# EAGLE design NMEA0183Breakout-ISO-4.3 (EAGLE 9.6.2)
Assembly variants: NMEA0183, JLCPCB

## Sheet 1 of 4
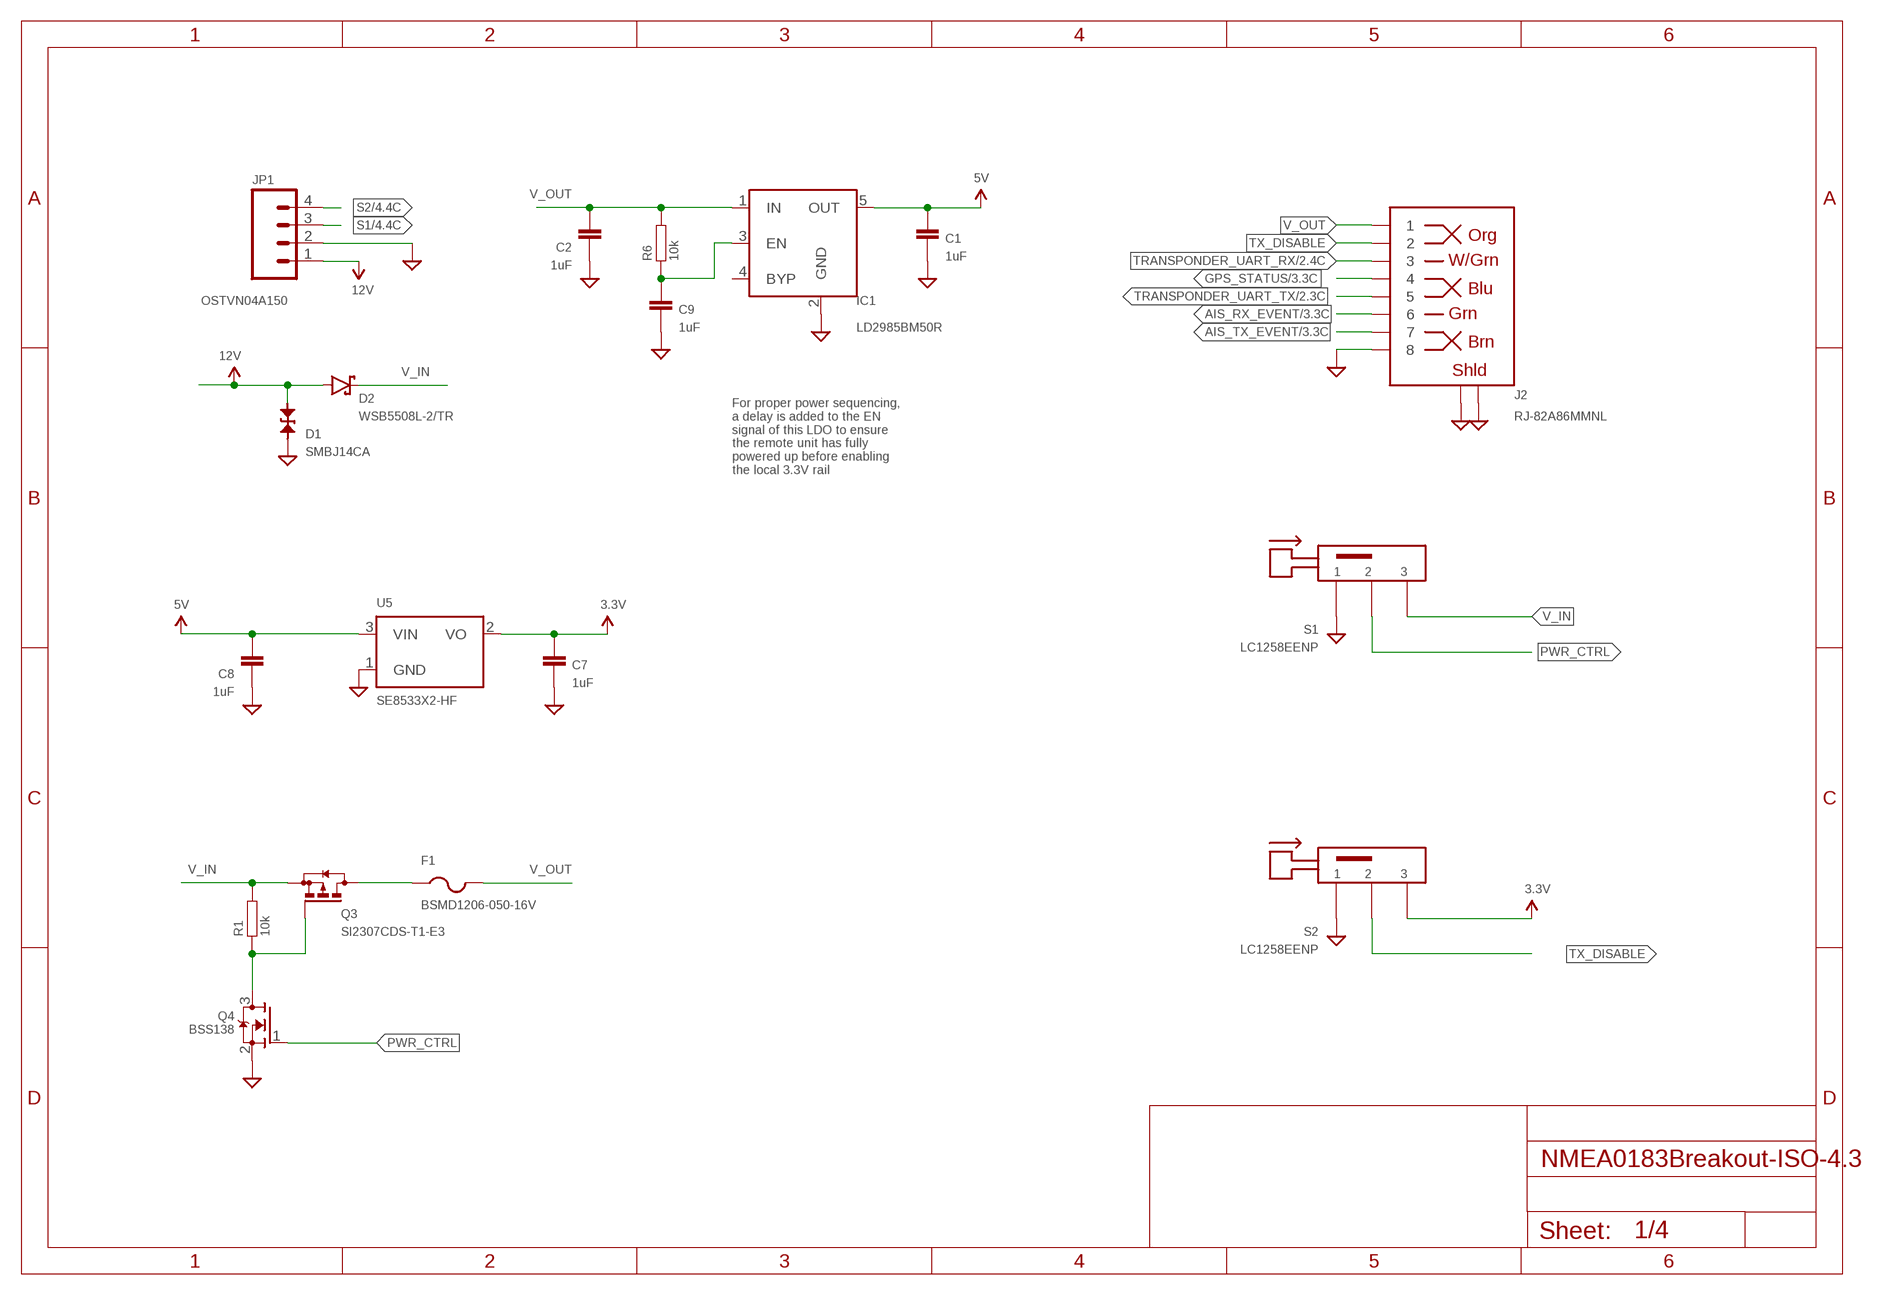
[diagram p0: schematic, sheet 1]

### Parts
C1  1uF  CAPACITOR0603  [0603]
C2  1uF  CAPACITOR0603  [0603]
C7  1uF  CAPACITOR0603  [0603]
C8  1uF  CAPACITOR0603  [0603]
C9  1uF  CAPACITOR0603  [0603]
D1  SMBJ14CA  DIODE-TVS-BIDIRSMB  [SMB-BIDIR]
D2  WSB5508L-2/TR  DIODE-SCHOTTKYSOD123  [SOD123]
F1  BSMD1206-050-16V  PTCFUSE-1206  [R1206]
IC1  LD2985BM50R  MIC5219XX  [SOT23-5]
J2  RJ-82A86MMNL  [RJ-82A86MMNL]
JP1  OSTVN04A150  M04PTH  [1X04]
Q3  SI2307CDS-T1-E3  BSS84  [SOT23]
Q4  BSS138  MOSFET-NREFLOW  [SOT23]
R1  10k  RESISTOR0603  [0603]
R6  10k  RESISTOR0603  [0603]
S1  LC1258EENP  LC1258XXNP  [LC1258XXNP]
S2  LC1258EENP  LC1258XXNP  [LC1258XXNP]
U5  SE8533X2-HF  MCP1799T  [SOT23]

### Nets
3.3V: C7.P$1 S2.P$3 U5.2(VO) ; also sheet 2,3
5V: C1.P$1 C8.P$1 IC1.5(OUT) U5.3(VIN) ; also sheet 4
12V: D1.A D2.A JP1.1
AIS_RX_EVENT: J2.P$6 ; also sheet 3
AIS_TX_EVENT: J2.P$7 ; also sheet 3
GND: C1.P$2 C2.P$2 C7.P$2 C8.P$2 C9.P$2 D1.C IC1.2(GND) J2.P$8 J2.P$9(SHLD) J2.P$10(SHLD) J2.P$11(SHLD) J2.P$12(SHLD) JP1.2 Q4.2(S) S1.P$1 S2.P$1 U5.1(GND) ; also sheet 2,3,4
GPS_STATUS: J2.P$4 ; also sheet 3
N$7: C9.P$1 IC1.3(EN) R6.P$1
N$8: Q3.1(G) Q4.3(D) R1.P$1
N$10: F1.1 Q3.3(D)
PWR_CTRL: Q4.1(G) S1.P$2
S1: JP1.3 ; also sheet 4
S2: JP1.4 ; also sheet 4
TRANSPONDER_UART_RX: J2.P$3 ; also sheet 2
TRANSPONDER_UART_TX: J2.P$5 ; also sheet 2,4
TX_DISABLE: J2.P$2 S2.P$2
V_IN: D2.C Q3.2(S) R1.P$2 S1.P$3
V_OUT: C2.P$1 F1.2 IC1.1(IN) J2.P$1 R6.P$2
Unconnected: IC1.4(BYP)

### Notes on the sheet
- For proper power sequencing,
  a delay is added to the EN
  signal of this LDO to ensure
  the remote unit has fully
  powered up before enabling
  the local 3.3V rail

## Sheet 2 of 4
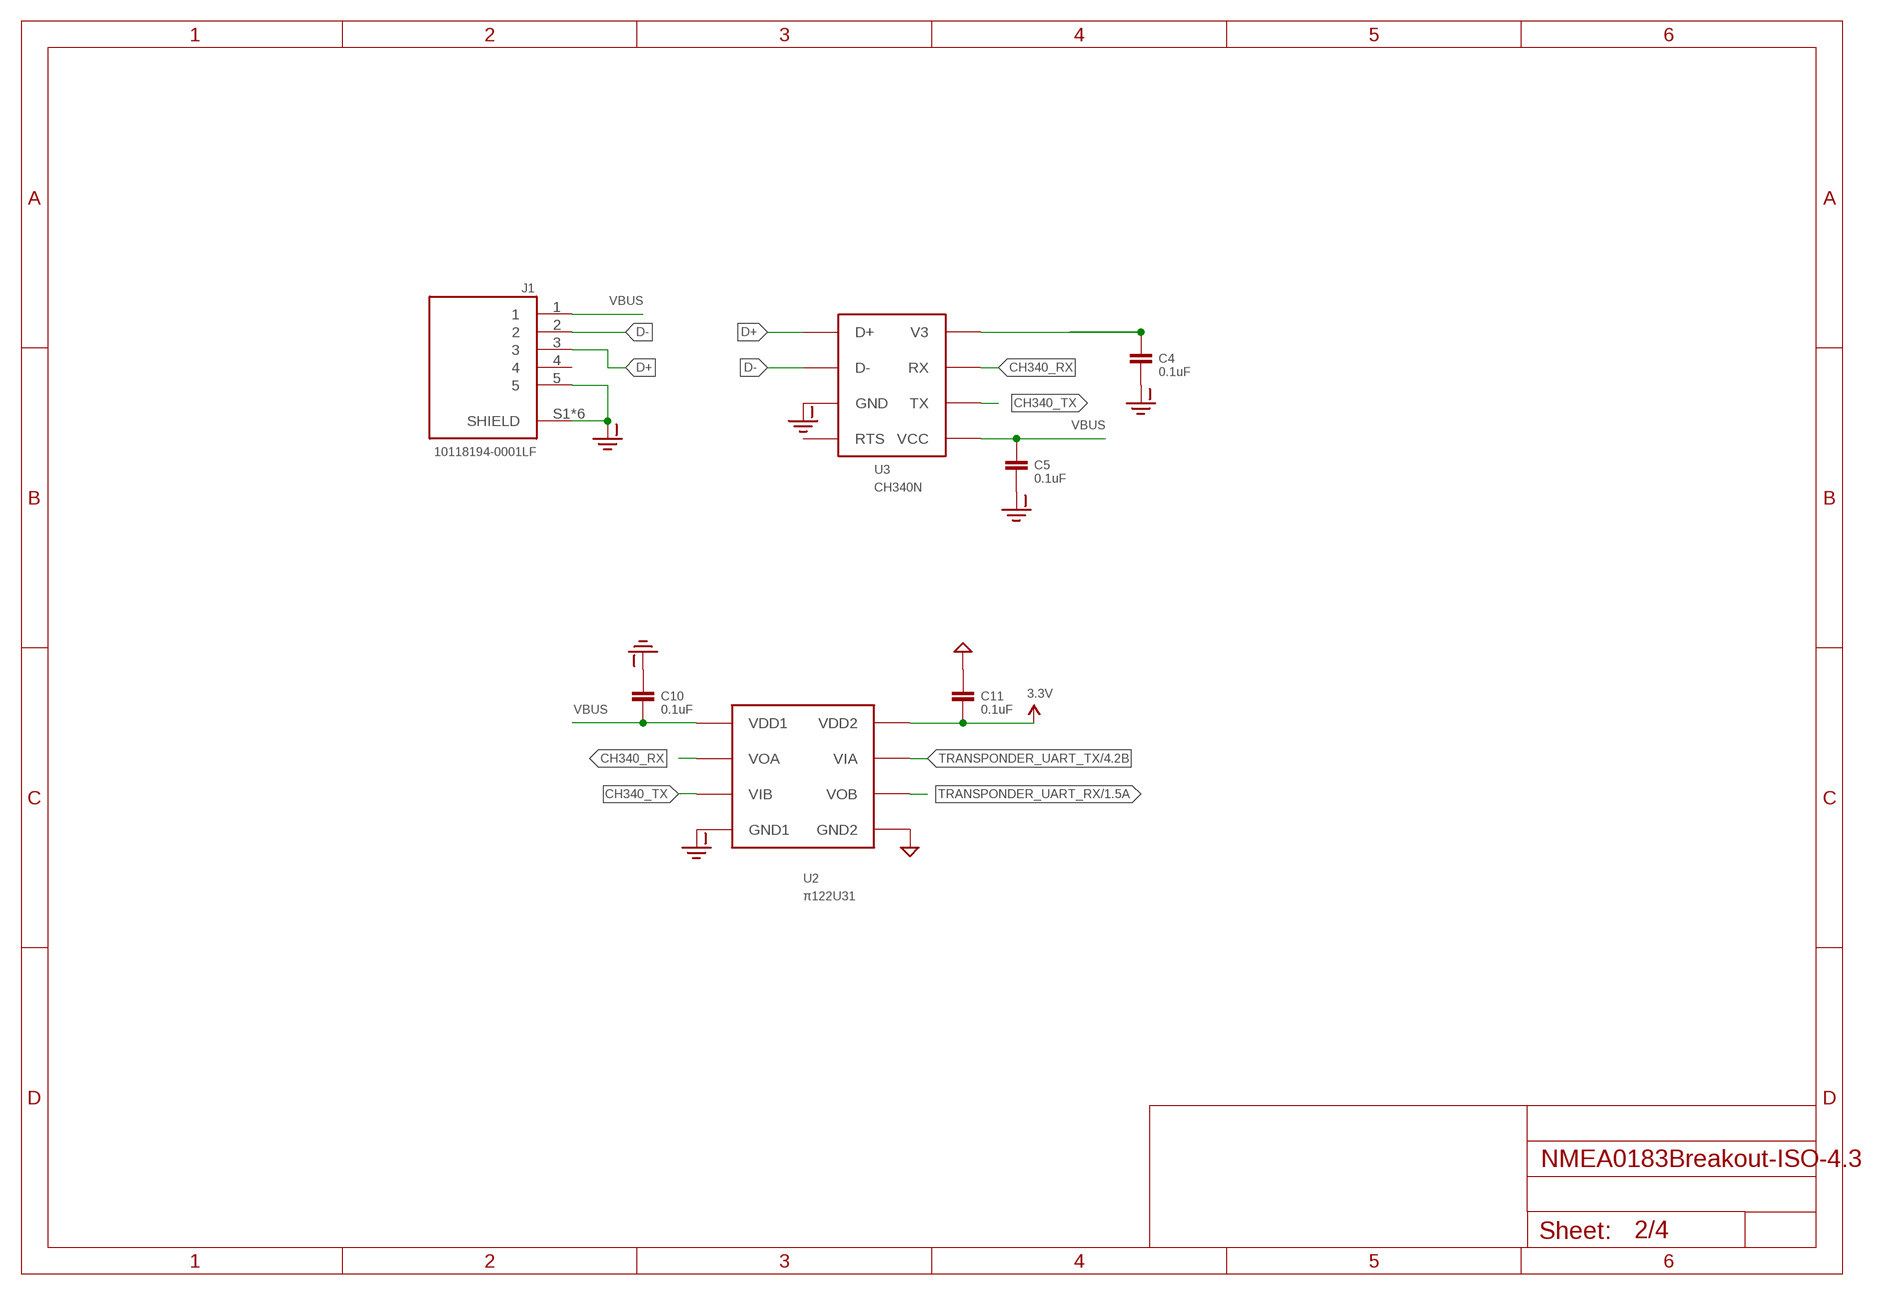
[diagram p1: schematic, sheet 2]

### Parts
C4  0.1uF  CAPACITOR0603  [0603]
C5  0.1uF  CAPACITOR0603  [0603]
C10  0.1uF  CAPACITOR0603  [0603]
C11  0.1uF  CAPACITOR0603  [0603]
J1  10118194-0001LF  [AMPHENOL_10118194-0001LF]
U2  π122U31  PI122U3X  [SOIC8]
U3  CH340N  CH330N  [SOIC-8]

### Nets
3.3V: C11.P$2 U2.8(VDD2) ; also sheet 1,3
CH340_RX: U2.2(VOA) U3.7(RX)
CH340_TX: U2.3(VIB) U3.6(TX)
D+: J1.3 U3.1(D+)
D-: J1.2 U3.2(D-)
GND: C11.P$1 U2.5(GND2) ; also sheet 1,3,4
GND-ISO: C4.P$2 C5.P$2 C10.P$1 J1.5 J1.S1(SHIELD) J1.S2(SHIELD) J1.S3(SHIELD) J1.S4(SHIELD) J1.S5(SHIELD) J1.S6(SHIELD) U2.4(GND1) U3.3(GND)
N$1: C4.P$1 U3.8(V3)
TRANSPONDER_UART_RX: U2.6(VOB) ; also sheet 1
TRANSPONDER_UART_TX: U2.7(VIA) ; also sheet 1,4
VBUS: C5.P$1 C10.P$2 J1.1 U2.1(VDD1) U3.5(VCC)
Unconnected: J1.4 U3.4(RTS)

## Sheet 3 of 4
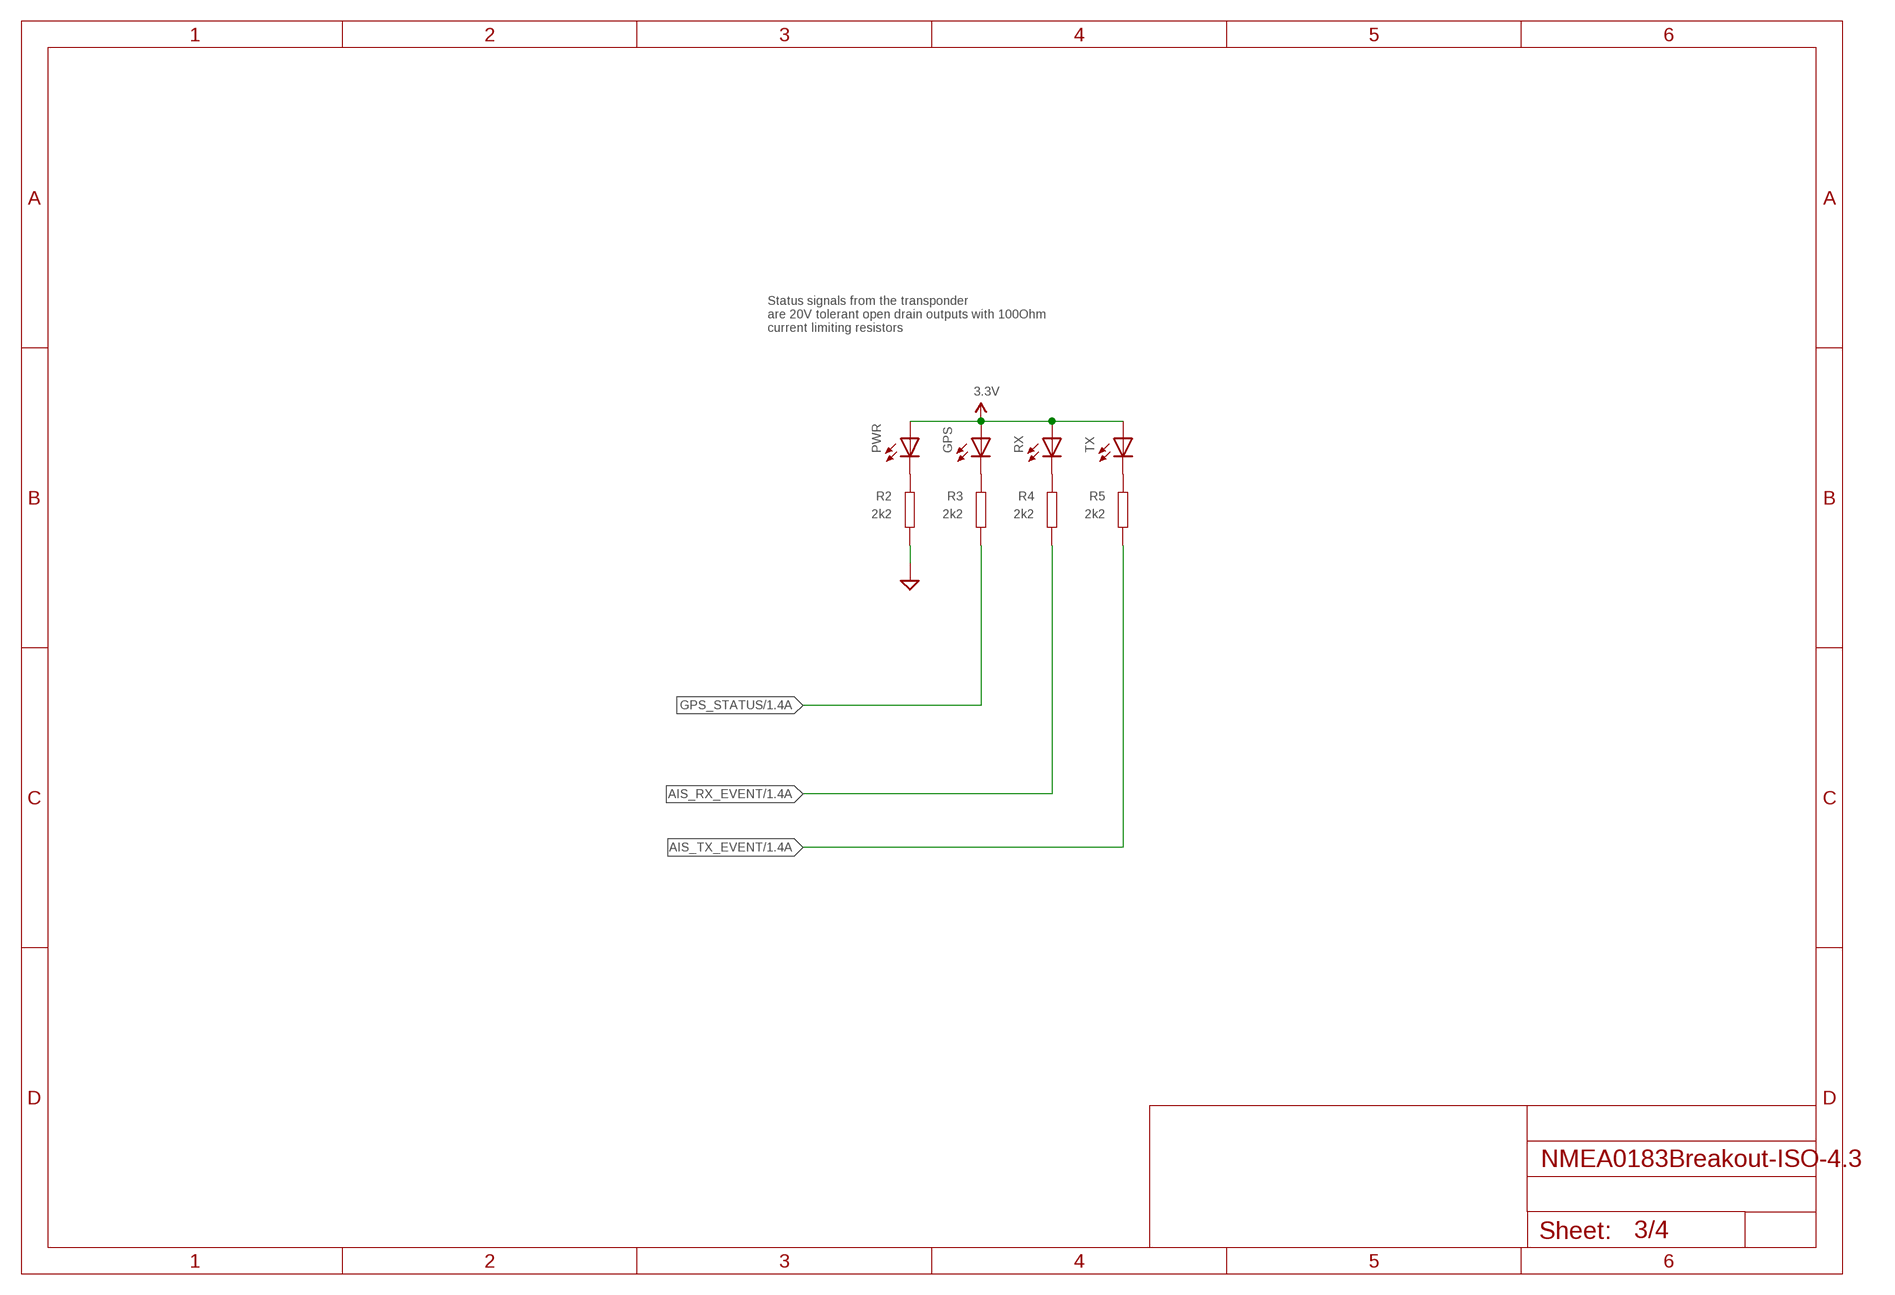
[diagram p2: schematic, sheet 3]

### Parts
GPS  LEDCHIPLED_1206  [CHIPLED_1206]
PWR  LEDCHIPLED_1206  [CHIPLED_1206]
R2  2k2  RESISTOR0603  [0603]
R3  2k2  RESISTOR0603  [0603]
R4  2k2  RESISTOR0603  [0603]
R5  2k2  RESISTOR0603  [0603]
RX  LEDCHIPLED_1206  [CHIPLED_1206]
TX  LEDCHIPLED_1206  [CHIPLED_1206]

### Nets
3.3V: GPS.A PWR.A RX.A TX.A ; also sheet 1,2
AIS_RX_EVENT: R4.P$2 ; also sheet 1
AIS_TX_EVENT: R5.P$2 ; also sheet 1
GND: R2.P$2 ; also sheet 1,2,4
GPS_STATUS: R3.P$2 ; also sheet 1
N$2: PWR.C R2.P$1
N$3: GPS.C R3.P$1
N$4: R4.P$1 RX.C
N$6: R5.P$1 TX.C

### Notes on the sheet
- Status signals from the transponder
  are 20V tolerant open drain outputs with 100Ohm 
  current limiting resistors

## Sheet 4 of 4
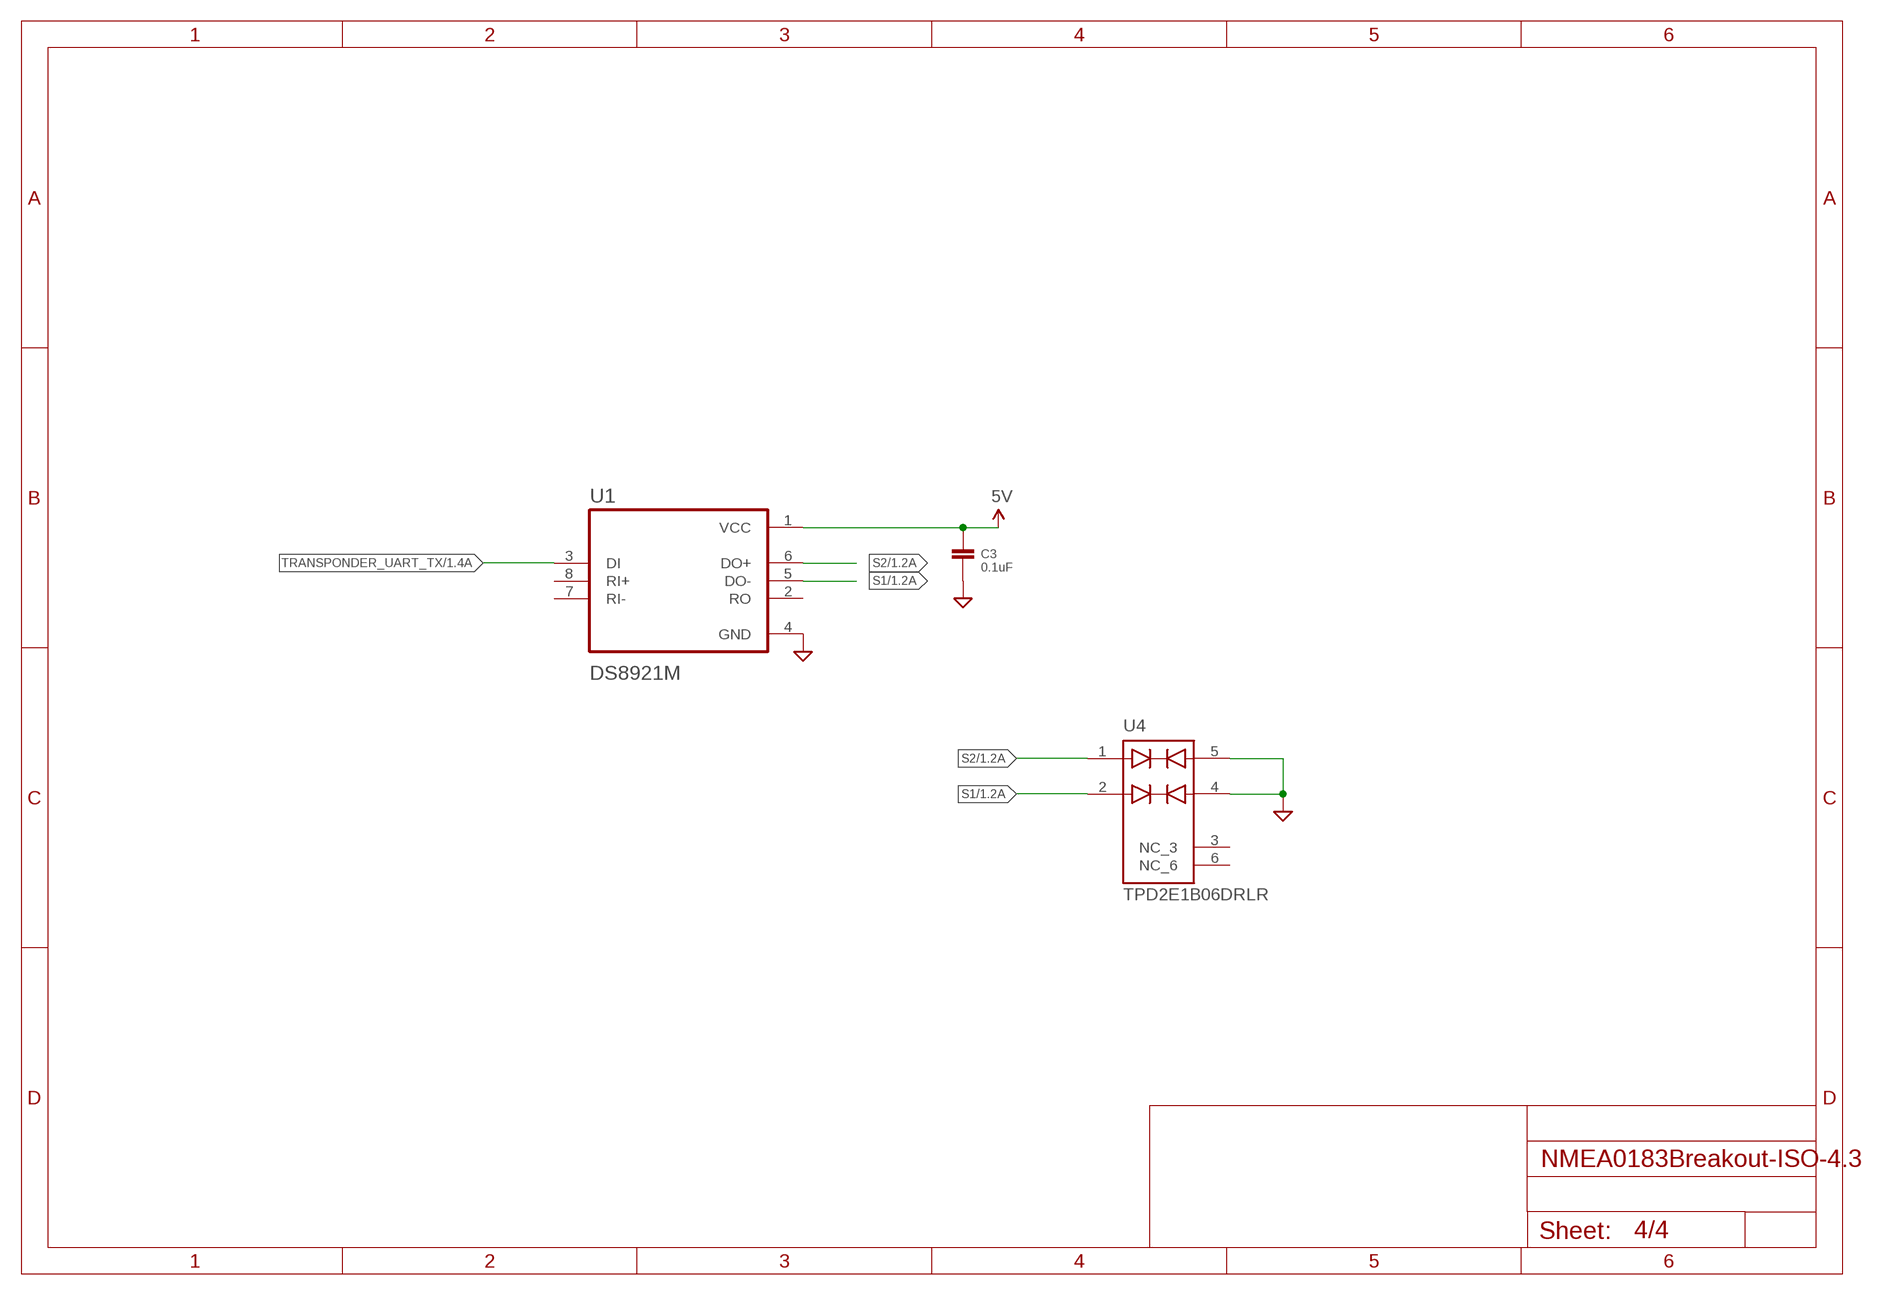
[diagram p3: schematic, sheet 4]

### Parts
C3  0.1uF  CAPACITOR0603  [0603]
U1  DS8921M  [SOIC127P599X175-8N]
U4  TPD2E1B06DRLR  [SOTFL50P160X60-6N]

### Nets
5V: C3.P$1 U1.1(VCC) ; also sheet 1
GND: C3.P$2 U1.4(GND) U4.4(IOB2) U4.5(IOA2) ; also sheet 1,2,3
S1: U1.5(DO-) U4.2(IOB1) ; also sheet 1
S2: U1.6(DO+) U4.1(IOA1) ; also sheet 1
TRANSPONDER_UART_TX: U1.3(DI) ; also sheet 1,2
Unconnected: U1.2(RO) U1.7(RI-) U1.8(RI+) U4.3(NC_3) U4.6(NC_6)

## Library data of the parts
C1 C2 C7-C9 = MyPassives:CAPACITOR: Standard SMD capacitor; PARTNO: CC0603KRX5R8BB105
C3-C5 C10 C11 = MyPassives:CAPACITOR: Standard SMD capacitor; PARTNO: 06035C104KAT2A
D1 = MyDiodes:DIODE-TVS-BIDIR: Bidirectional TVS diode; PARTNO: SMBJ14CA
D2 = MyDiodes:DIODE-SCHOTTKY: Standard SMD Schottky diode; PARTNO: WSB5508L-2/TR
F1 = adafruit:PTCFUSE: PTC fuses, resettable thermistors; PARTNO: BSMD1206-050-16V
GPS PWR RX TX = led:LED: LED OSRAM: - CHIPLED LG R971, LG N971, LY N971, LG Q971, LY Q971, LO R971, LY R971 LH N974, LH R974 LS Q976, LO Q976, LY Q976 LO Q996 - Hyper CHIPLED LW Q18S LB Q993, LB Q99A, LB R99A - SideLED LS A670, LO A670, LY A670, LG A670, LP A670 LB A673, LV A673, LT A673, LW A673 LH A674 LY A675 LS A676, LA A676, LO A676, LY A676, LW A676 LS A679, LY A679, LG A679 - Hyper Micro SIDELED® LS Y876, LA Y876, LO Y876, LY Y876 LT Y87S - SmartLED LW L88C, LW L88S LB L89C, LB L89S, LG L890 LS L89K, LO L89K, LY L89K LS L896, LA L896, LO L896, LY L896 - TOPLED LS T670, LO T670, LY T670, LG T670, LP T670 LSG T670, LSP T670, LSY T670, LOP T670, LYG T670 LG T671, LOG T671, LSG T671 LB T673, LV T673, LT T673, LW T673 LH T674 LS T676, LA T676, LO T676, LY T676, LB T676, LH T676, LSB T676, LW T676 LB T67C, LV T67C, LT T67C, LS T67K, LO T67K, LY T67K, LW E67C LS E67B, LA E67B, LO E67B, LY E67B, LB E67C, LV E67C, LT E67C LW T67C LS T679, LY T679, LG T679 LS T770, LO T770, LY T770, LG T770, LP T770 LB T773, LV T773, LT T773, LW T773 LH T774 LS E675, LA E675, LY E675, LS T675 LS T776, LA T776, LO T776, LY T776, LB T776 LHGB T686 LT T68C, LB T68C - Hyper Mini TOPLED® LB M676 - Mini TOPLED Santana® LG M470 LS M47K, LO M47K, LY M47K Source: http://www.osram.convergy.de LUXEON: - LUMILED® LXK2-PW12-R00, LXK2-PW12-S00, LXK2-PW14-U00, LXK2-PW14-V00 LXK2-PM12-R00, LXK2-PM12-S00, LXK2-PM14-U00 LXK2-PE12-Q00, LXK2-PE12-R00, LXK2-PE12-S00, LXK2-PE14-T00, LXK2-PE14-U00 LXK2-PB12-K00, LXK2-PB12-L00, LXK2-PB12-M00, LXK2-PB14-N00, LXK2-PB14-P00, LXK2-PB14-Q00 LXK2-PR12-L00, LXK2-PR12-M00, LXK2-PR14-Q00, LXK2-PR14-R00 LXK2-PD12-Q00, LXK2-PD12-R00, LXK2-PD12-S00 LXK2-PH12-R00, LXK2-PH12-S00 LXK2-PL12-P00, LXK2-PL12-Q00, LXK2-PL12-R00 Source: www.luxeon.com KINGBRIGHT: KA-3528ASYC Source: www.kingbright.com; PARTNO: TJ-S3216CL9T5ALC2G-A5
IC1 = v-reg-micrel:MIC5219XX: VOLTAGE REGULATOR; OC_FARNELL: unknown; OC_NEWARK: unknown; PARTNO: LD2985BM50R
J1 = 10118194-0001LF:10118194-0001LF: Micro Usb, 2.0 Type b, Rcpt, Smt Check prices <https://snapeda.com/parts/10118194-0001LF/Amphenol%20ICC%20%28FCI%29/view-part/?ref=eda>; ARROW_ELECTRONICS-PURCHASE-URL: https://snapeda.com/shop?store=Arrow+Electronics&id=4816633; AVAILABILITY: Good; DESCRIPTION: USB - micro B USB 2.0 Receptacle Connector 5 Position Surface Mount, Right Angle; Through Hole; DIGIKEY-PURCHASE-URL: https://snapeda.com/shop?store=DigiKey&id=4816633; MF: Amphenol ICC (FCI); MOUSER-PURCHASE-URL: https://snapeda.com/shop?store=Mouser&id=4816633; MP: 10118194-0001LF; PACKAGE: None; PARTNO: 10118194-0001LF; PRICE: None
J2 = xyfw:RJ-82A86MMNL: Mid-mount RJ45 jack; PARTNO: RJ-82A86MMNL
JP1 = SparkFun-Connectors:M04: Header 4 Standard 4-pin 0.1" header. Use with straight break away headers (SKU : PRT-00116), right angle break away headers (PRT-00553), swiss pins (PRT-00743), machine pins (PRT-00117), and female headers (PRT-00115). Molex polarized connector foot print use with SKU : PRT-08231 with associated crimp pins and housings. 1MM SMD Version SKU: PRT-10208; PARTNO: OSTVN04A150
Q3 = transistor-small-signal:BSS84: P-CHANNEL MOS FET; PARTNO: SI2307CDS-T1-E3
Q4 = adafruit:MOSFET-N: N-Channel Mosfet 2N7002E - 60V 260mA SOT23 [Digikey: 2N7002ET1GOSTR-ND] - REEL BSH103 - 30V 850mA SOT23 [Digikey: 568-5013-1-ND]; PARTNO: BSS138
R1 R6 = MyPassives:RESISTOR: Standard SMD resistor; PARTNO: RC0603FR-0710KL
R2-R5 = MyPassives:RESISTOR: Standard SMD resistor; PARTNO: CR0603-FX-2201ELF
S1 S2 = e-switch:LC1258XXNP: E-Switch SPDT pushbutton; PARTNO: LC1258EENP
U1 = DS8921M:DS8921M: Check prices <https://pricing.snapeda.com/parts/DS8921M/NOPB/Texas%20Instruments/view-part?ref=eda>; AVAILABILITY: In Stock; DESCRIPTION: Differential Line Drivers and Receiver Pair 8-SOIC 0 to 70; MF: Texas Instruments; MP: DS8921M/NOPB; PACKAGE: SOIC-8 Texas Instruments; PARTNO: DS8921M; PRICE: None; PURCHASE-URL: https://pricing.snapeda.com/search/part/DS8921M/NOPB/?ref=eda
U2 = 2paisemi:PI122U3X: 2 Channel Capacitive Divider Isolator; PARTNO: π122U31
U3 = JiangsuQinHeng:CH330N: USB to UART bridge; PARTNO: CH340N
U4 = TPD2E1B06DRLR:TPD2E1B06DRLR: 2-channel System-level ESD protection device for USB interfaces 6-SOT-5X3 -40 to 125 Check prices <https://pricing.snapeda.com/parts/TPD2E1B06DRLR/Texas%20Instruments/view-part?ref=eda>; AVAILABILITY: In Stock; DESCRIPTION: 2-channel System-level ESD protection device for USB interfaces 6-SOT-5X3 -40 to 125; MF: Texas Instruments; MP: TPD2E1B06DRLR; PACKAGE: SOT-5X3-6 Texas Instruments; PARTNO: TPD2E1B06DRLR; PRICE: None; PURCHASE-URL: https://pricing.snapeda.com/search/part/TPD2E1B06DRLR/?ref=eda
U5 = microchip:MCP1799T: 80mA High Voltage Automotive LDO; PARTNO: SE8533X2-HF; VALUE: MCP1799T

## Board
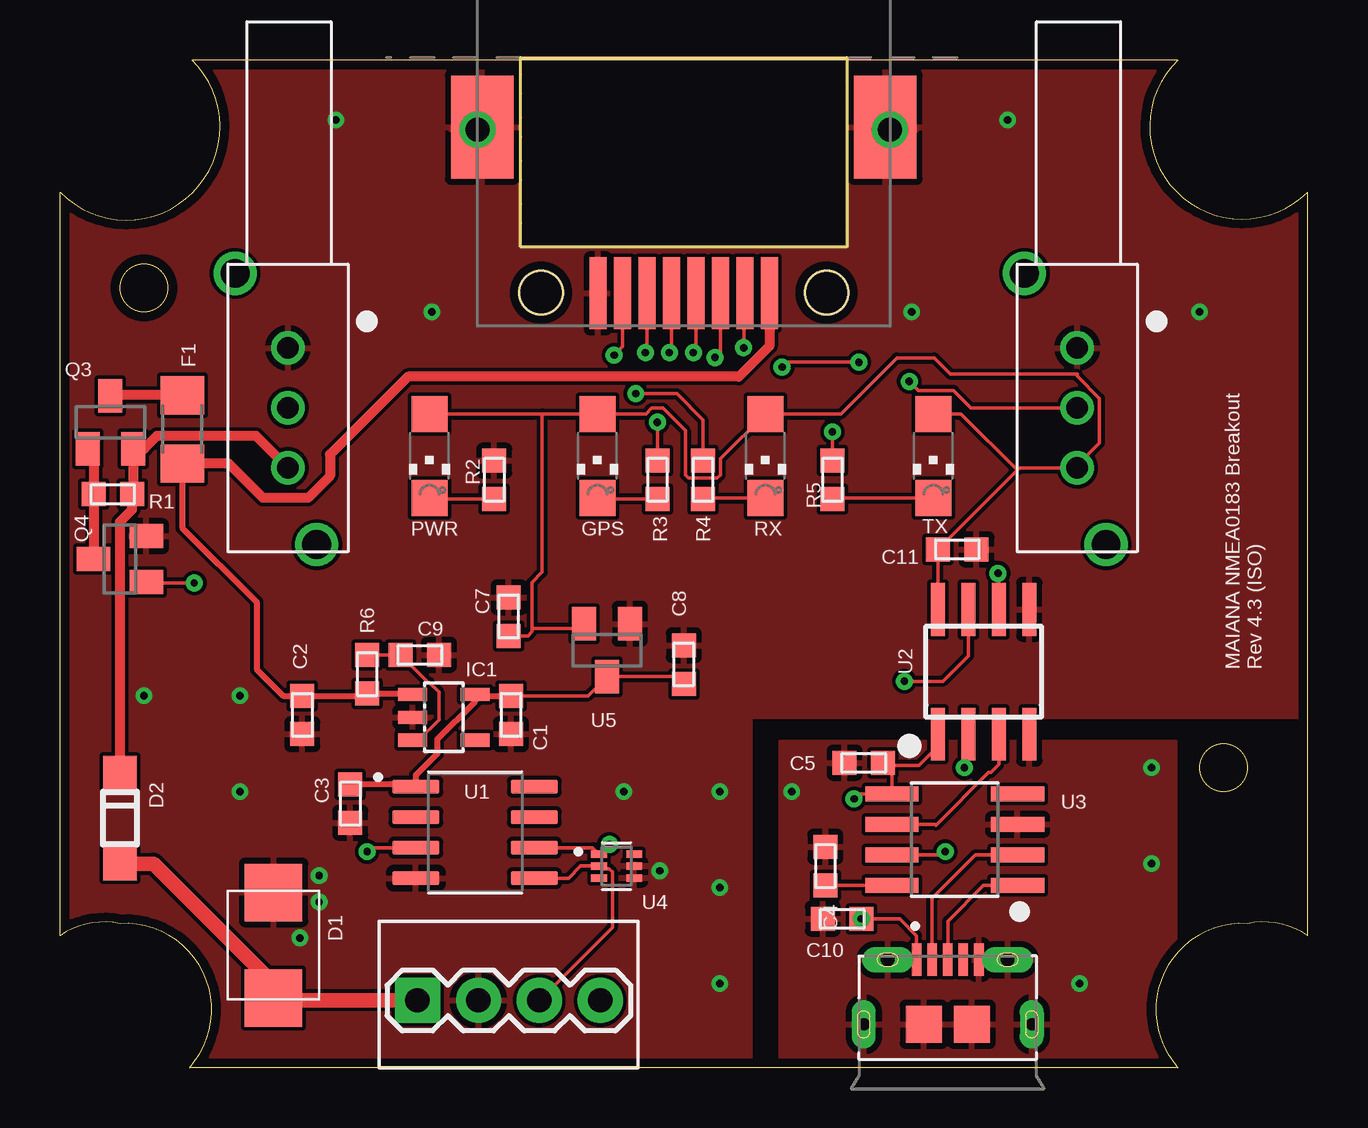
[diagram p4: board, top side]
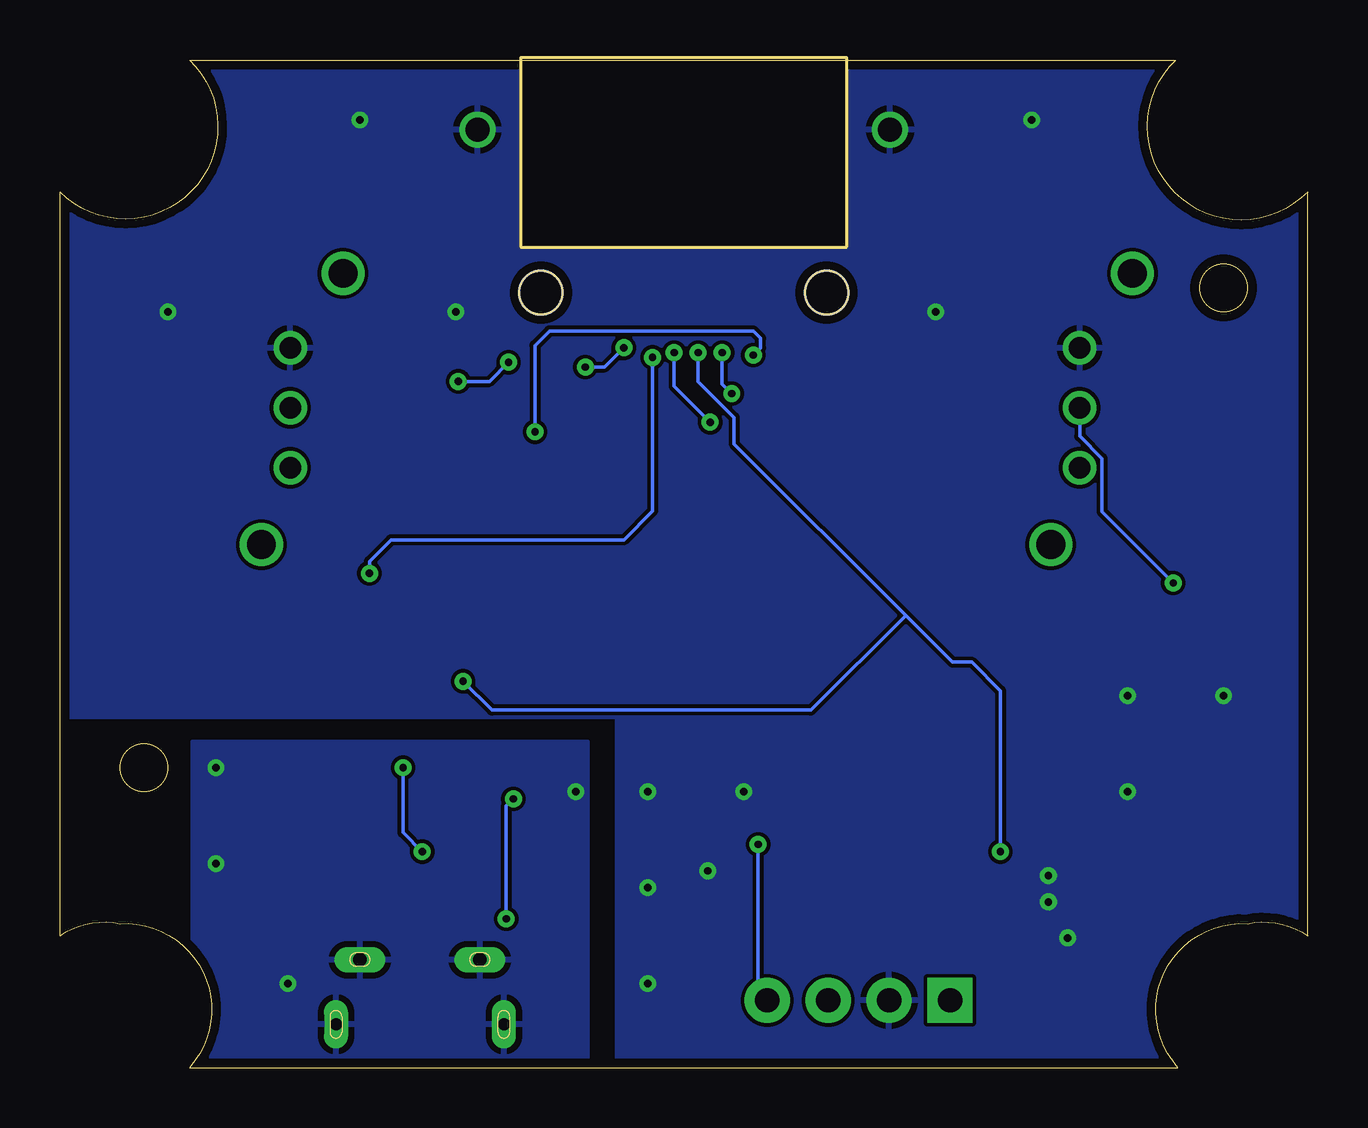
[diagram p5: board, bottom side, seen from below]

Size 52 x 42 mm. Coordinates in mm from the lower left corner, seen from the top.
Outline: 46.6,0 5.4,0 arc136 2.5,6 arc46 0,5.5 0,36.5 arc181 5.5,42 46.6,42 arc181 52,36.5 52,5.5 arc46 49.5,6 arc136 46.6,0
Outline: circle at 3.5,32.5 radius 1
Outline: circle at 48.5,12.5 radius 1
Copper layers (1*16): Top 0.035mm / dielectric 1.5mm / Bottom 0.035mm
Design rules "default *": minimum track width 6mil, minimum drill 0.3mm, track to track 6mil, track to pad 6mil, pad to pad 6mil, via to via 6mil, smd to smd 0mil, copper to edge 15mil, drill to drill 6mil, minimum pad ring 10mil, minimum via ring 8mil, stop-mask expansion 1mil, vias tented up to drill 20mil, thermal gap 10mil

### Footprints (pad centres in the part's own frame; a part is rotated, then mirrored left to right if it is on the bottom)
0603 = smd 1 x 1: P$1 -0.8,0; P$2 0.8,0
SMB-BIDIR = smd 2.4 x 2.4: A 2.2,0; C -2.2,0
SOD123 = smd 1.4 x 1.4: A 1.9,0; C -1.9,0
R1206 = smd 1.6 x 1.803: 1 -1.422,0; 2 1.422,0
CHIPLED_1206 = smd 1.5 x 1.5: A 0,-1.75; C 0,1.75
SOT23-5 = smd 0.55 x 1.2: 1 -0.95,-1.3; 2 0,-1.3; 3 0.95,-1.3; 4 0.95,1.3; 5 -0.95,1.3
AMPHENOL_10118194-0001LF = smd 0.4 x 1.35: 1 -1.3,2.7; 2 -0.65,2.7; 3 0,2.7; 4 0.65,2.7; 5 1.3,2.7 | drill 0.55 pad 0.65 long: S1 -2.5,2.7; S2 2.5,2.7 | drill 0.5 pad 0.775 long: S3 -3.5,0; S6 3.5,0 | smd 1.5 x 1.55: S4 -1,0; S5 1,0
RJ-82A86MMNL = smd 0.7 x 3: P$1 -3.57,3.82; P$2 -2.55,3.82; P$3 -1.53,3.82; P$4 -0.51,3.82; P$5 0.51,3.82; P$6 1.53,3.82; P$7 2.55,3.82; P$8 3.57,3.82 | smd 2.6 x 4.3: P$9 -8.4,-3.1; P$10 8.4,-3.1 | drill 1: P$11 -8.6,-3; P$12 8.6,-3 | hole 1.8: -5.95,3.8; 5.95,3.8
1X04 = drill 1.016 pad 1.88 square: 1 0,0 | drill 1.016 pad 1.88: 2 2.54,0; 3 5.08,0; 4 7.62,0
SOT23 = smd 1 x 1.4: 1 -0.95,-1.1; 2 0.95,-1.1; 3 0,1.1
LC1258XXNP = drill 0.9: P$1 2.5,0; P$2 0,0; P$3 -2.5,0 | drill 1.2: P$4 -5.7,-1.2; P$5 5.6,2.2
SOIC127P599X175-8N = smd 1.97 x 0.6: 1 -2.47,1.905; 2 -2.47,0.635; 3 -2.47,-0.635; 4 -2.47,-1.905; 5 2.47,-1.905; 6 2.47,-0.635; 7 2.47,0.635; 8 2.47,1.905
SOIC8 = smd 0.6 x 2.2: 1 -1.905,-2.6; 2 -0.635,-2.6; 3 0.635,-2.6; 4 1.905,-2.6; 5 1.905,2.6; 6 0.635,2.6; 7 -0.635,2.6; 8 -1.905,2.6
SOIC-8 = smd 2.21 x 0.61: 1 -2.616,1.905; 2 -2.616,0.635; 3 -2.616,-0.635; 4 -2.616,-1.905; 5 2.616,-1.905; 6 2.616,-0.635; 7 2.616,0.635; 8 2.616,1.905
SOTFL50P160X60-6N = smd 0.66 x 0.31: 1 -0.735,0.5; 2 -0.735,0; 3 -0.735,-0.5; 4 0.735,-0.5; 5 0.735,0; 6 0.735,0.5

### Placement (x,y rotation side)
C1  18.8,14.7 270 top
C2  10.1,14.7 270 top
C3  12.1,11 270 top
C4  31.9,8.4 90 top
C5  33.5,12.7 180 top
C7  18.7,18.8 90 top
C8  26,16.8 90 top
C9  15,17.2 0 top
C10  32.6,6.2 0 top
C11  37.4,21.6 180 top
D1  8.9,5.1 270 top
D2  2.5,10.4 270 top
F1  5.1,26.6 270 top
GPS  22.4,25.5 180 top
IC1  16,14.6 270 top
J1  37,1.8 0 top
J2  26,36.1 180 top
JP1  14.9,2.8 0 top
PWR  15.4,25.5 180 top
Q3  2.1,26.9 0 top
Q4  2.5,21.2 90 top
R1  2.2,23.9 0 top
R2  18.1,24.5 90 top
R3  24.9,24.5 90 top
R4  26.8,24.5 90 top
R5  32.2,24.5 90 top
R6  12.8,16.4 270 top
RX  29.4,25.5 180 top
S1  9.5,27.5 90 top
S2  42.4,27.5 90 top
TX  36.4,25.5 180 top
U1  17.3,9.8 0 top
U2  38.5,16.5 0 top
U3  37.3,9.5 180 top
U4  23.2,8.4 0 top
U5  22.8,17.4 180 top

### Tracks (layer width: path | path; a pad name or v marks a point on that pad's centre or on a via)
3.3V
  Top 0.152: C7.P$1 19.5,18 19.67,18.17 19.67,18.3 | PWR.A 20.1,27.25 | 20.1,27.25 GPS.A 24.43,27.25 24.66,27.48 25.14,27.48 26.07,26.55 26.07,24.7 26.2,24.57 27.39,24.57 27.53,24.7 27.53,25.38 RX.A 32.55,27.25 34.88,29.58 36.44,29.58 37.12,28.9 42.4,28.9 42.4,28.82 43.33,27.89 43.33,26.03 42.3,25 | 20.1,27.25 20.1,20.65 19.67,20.22 19.67,18.3 | U2.8 C11.P$2 39.9,24.9 | 39.9,24.9 40,25 42.3,25 | 42.3,25 S2.P$3 | TX.A 37.55,27.25 39.9,24.9 | U5.2 21.65,18.3 19.67,18.3
5V
  Top 0.152: IC1.5 17.35,15.5 | U1.1 14.73,11.8 | C8.P$1 25.7,16.3 U5.3 22,15.5 C1.P$1
  Top 0.254: 17.35,15.5 C1.P$1 | IC1.5 17.3,15.25 15.73,13.68 15.73,13.08 14.83,12.18 U1.1 | 14.73,11.8 C3.P$1
12V
  Top 0.61: JP1.1 9,2.8 D1.A 8.9,3.5 3.9,8.5 D2.A
AIS_RX_EVENT  (via drill 0.3)
  Top 0.152: J2.P$6 24.47,29.87 v24.4,29.8 | v24,28.09 25.71,28.09 26.8,27 R4.P$2
  Bottom 0.152: v24.4,29.8 24.4,28.49 v24,28.09
AIS_TX_EVENT  (via drill 0.3)
  Top 0.152: J2.P$7 23.45,30.05 v23.1,29.7 | v32.2,26.5 R5.P$2
  Bottom 0.152: v23.1,29.7 22.8,30 22.8,30.4 23.1,30.7 31.6,30.7 32.2,30.1 v32.2,26.5
CH340_RX  (via drill 0.3)
  Top 0.152: U3.7 36.77,8.87 v36.9,9 | v37.7,12.5 37.7,13.3 37.87,13.46 U2.2
  Bottom 0.152: v36.9,9 37.7,9.8 v37.7,12.5
CH340_TX
  Top 0.152: U3.6 36.47,10.13 36.5,10.1 38.7,12.3 38.8,12.3 39.13,12.63 U2.3
D+
  Top 0.152: J1.3 37,6.1 38.49,7.6 U3.1
D-
  Top 0.152: J1.2 36.35,7.05 38.16,8.87 U3.2
GND  (via drill 0.3)
  other vias: 7.5,11.5 23.5,11.5 27.5,11.5 27.5,7.5 27.5,3.5 3.5,15.5 7.5,15.5 35.5,31.5 47.5,31.5 15.5,31.5 11.5,39.5 39.5,39.5 25,8.2 10.8,8 10.8,6.9 10,5.4
  pour Top: -1.5,43.5 53.5,43.5 53.5,14.6 28.8,14.6 28.8,-1.5 -1.5,-1.5
  pour Bottom: -2.5,44.5 55,44.5 55,14.6 28.8,14.6 28.8,-3.5 -2.5,-3.5
GND-ISO  (via drill 0.3)
  other vias: 42.5,3.5 45.5,8.5 30.5,11.5 45.5,12.5
  pour Top: 30,13.6 46.5,13.6 46.5,-1 30,-1
  pour Bottom: 30,13.6 46.5,13.6 46.5,-1 30,-1
GPS_STATUS  (via drill 0.3)
  Top 0.152: J2.P$4 26.51,29.91 v26.4,29.8 | v24.9,26.9 R3.P$2
  Bottom 0.152: v26.4,29.8 26.4,28.4 v24.9,26.9
N$1
  Top 0.152: U3.8 32.01,7.6 C4.P$1
N$2
  Top 0.152: R2.P$1 15.45,23.7 PWR.C
N$3
  Top 0.152: R3.P$1 22.45,23.7 GPS.C
N$4
  Top 0.152: R4.P$1 26.85,23.75 RX.C
N$6
  Top 0.152: R5.P$1 32.25,23.75 TX.C
N$7
  Top 0.152: R6.P$1 C9.P$1 15.35,16.05 15.39,16.05 15.8,15.65 15.8,14.5 14.95,13.65 IC1.3
N$8
  Top 0.406: Q3.1 1.4,25.55 R1.P$1 Q4.3
N$10
  Top 0.406: F1.1 2.12,28.02 Q3.3
PWR_CTRL  (via drill 0.3)
  Top 0.152: v5.6,20.2 3.65,20.2 Q4.1
  Bottom 0.152: S1.P$2 9.5,26.32 8.57,25.39 8.57,23.17 v5.6,20.2
S1
  Top 0.152: U1.5 21.2,7.89 21.7,8.4 U4.2 22.58,8.28 22.89,8.28 23.02,8.15 23.02,5.84 JP1.3
S2  (via drill 0.3)
  Top 0.152: U1.6 22.2,9.16 U4.1 22.86,9.3 v22.9,9.3
  Bottom 0.152: v22.9,9.3 22.9,3.18 JP1.4
TRANSPONDER_UART_RX  (via drill 0.3)
  Top 0.152: J2.P$3 27.53,29.83 v27.3,29.6 | v39.1,20.6 39.13,20.57 U2.6
  Bottom 0.152: v27.3,29.6 27.3,23.2 28.5,22 38.2,22 39.1,21.1 v39.1,20.6
TRANSPONDER_UART_TX  (via drill 0.3)
  Top 0.152: J2.P$5 25.49,29.89 v25.4,29.8 | v12.8,9 12.96,9.16 U1.3 | U2.7 37.87,17.16 36.8,16.1 v35.2,16.1
  Bottom 0.152: v25.4,29.8 25.4,28.6 23.9,27.1 23.9,26 16.75,18.85 | 16.75,18.85 14.8,16.9 14,16.9 12.8,15.7 v12.8,9 | v35.2,16.1 34,14.9 20.7,14.9 16.75,18.85
TX_DISABLE  (via drill 0.3)
  Top 0.152: v35.4,28.6 35.77,28.23 37.24,28.23 37.97,27.5 S2.P$2 | v33.3,29.4 30.3,29.4 v30.1,29.2 | v28.5,30 28.5,32.23 J2.P$2
  Bottom 0.152: v35.4,28.6 34.1,28.6 v33.3,29.4 | v30.1,29.2 29.3,29.2 v28.5,30
V_IN
  Top 0.406: S1.P$3 8.17,26.33 4.05,26.33 3.52,25.8 Q3.2 3.05,23.95 R1.P$2 3,23.25 2.5,22.75 D2.C
V_OUT
  Top 0.152: 12.7,15.5 R6.P$2 | 14.65,15.6 IC1.1
  Top 0.254: F1.2 5.1,22.5 8.2,19.4 8.2,16.6 9.3,15.5 C2.P$1 12.7,15.5 | R6.P$2 14.65,15.6
  Top 0.406: J2.P$1 29.57,30.07 28.3,28.8 14.5,28.8 11.26,25.56 11.26,24.66 10.34,23.74 8.46,23.74 7.02,25.18 F1.2
VBUS  (via drill 0.3)
  Top 0.152: J1.1 35.7,5.5 35,6.2 C10.P$2 | U2.1 36.59,13.39 35.8,12.6 34.4,12.6 C5.P$1 34.68,12.32 U3.5 33.3,11.4 v33.1,11.2
  Bottom 0.152: v33.1,11.2 33.4,10.9 C10.P$2
  other vias: 33.4,6.2

### Text on the board
tNames: MAIANA NMEA0183 Breakout / Rev 4.3 (ISO)